# Altium schematic sheet Sheet1.SchDoc
size A4
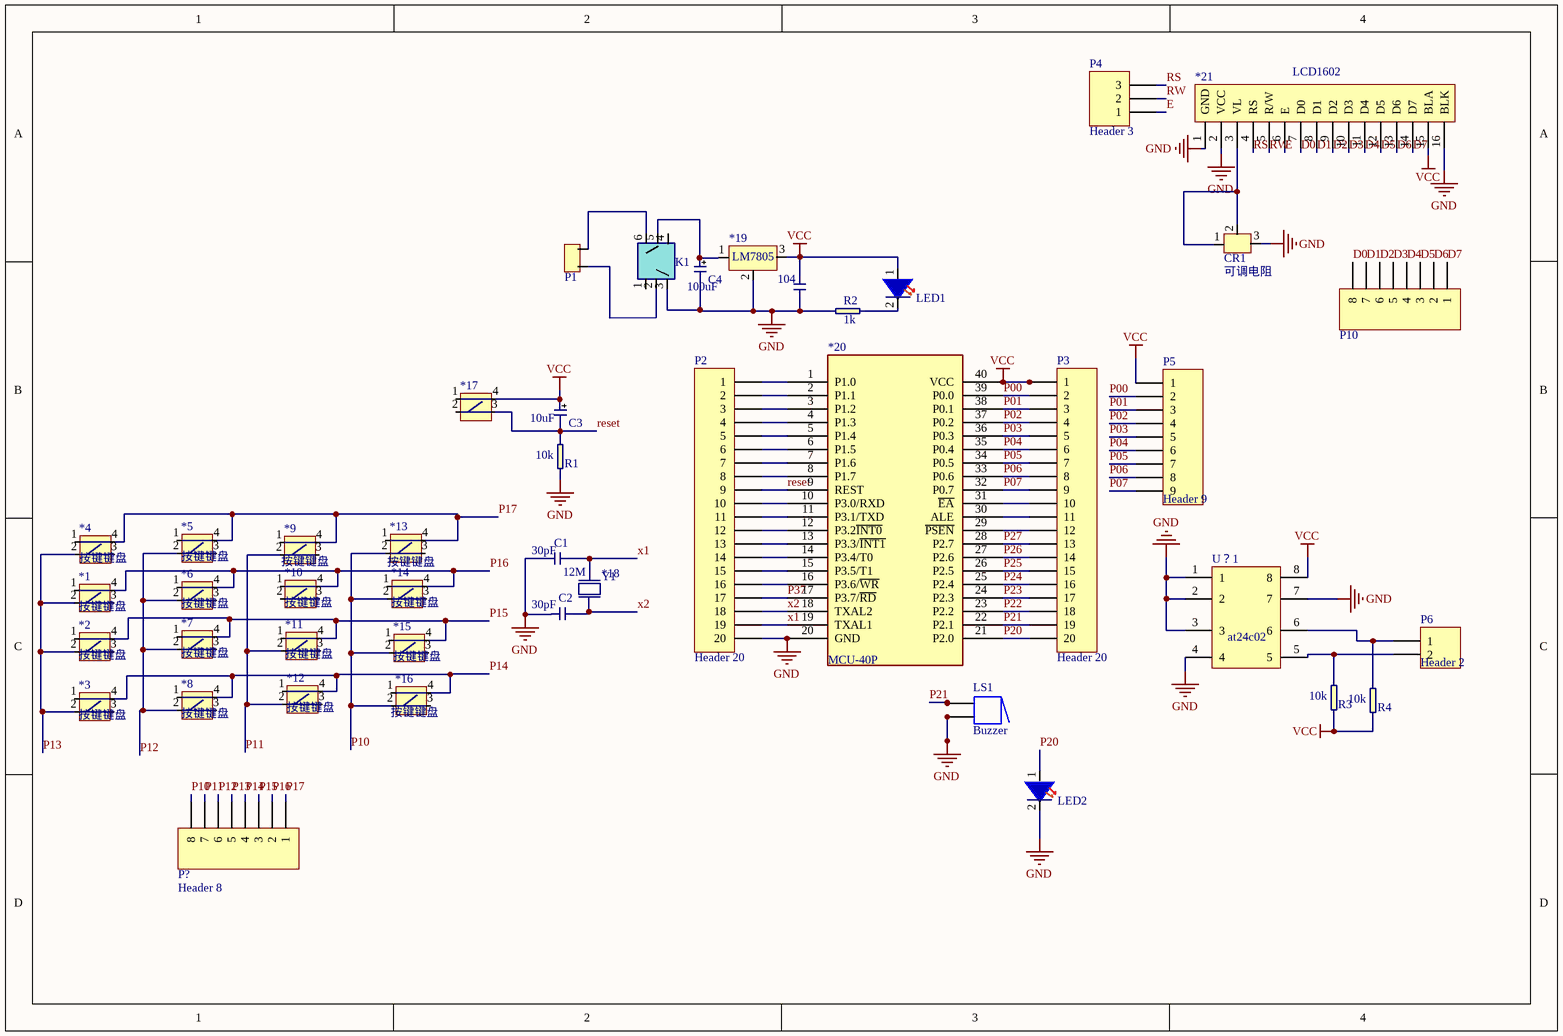
[diagram p0: Sheet1.SchDoc]

## Parts
*1  按键键盘  [按键键盘]
*2  按键键盘  [按键键盘]
*3  按键键盘  [按键键盘]
*4  按键键盘  [按键键盘]
*5  按键键盘  [按键键盘]
*6  按键键盘  [按键键盘]
*7  按键键盘  [按键键盘]
*8  按键键盘  [按键键盘]
*9  按键键盘  [按键键盘]
*10  按键键盘  [按键键盘]
*11  按键键盘  [按键键盘]
*12  按键键盘  [按键键盘]
*13  按键键盘  [按键键盘]
*14  按键键盘  [按键键盘]
*15  按键键盘  [按键键盘]
*16  按键键盘  [按键键盘]
*17  按键键盘  [按键键盘]  (value not drawn)
*18  Y1  [晶振]
*19  LM7805  [L7xxxCV]
*20  MCU-40P  [MCU-DIP40]
*21  LCD1602  [LCD1602]
C1  瓷片电容  [瓷片电容]  (value not drawn)
C2  瓷片电容  [瓷片电容]  (value not drawn)
C3  电解电容  [C8mm]  (value not drawn)
C4  电解电容  [C8mm]  (value not drawn)
C5  瓷片电容  [瓷片电容]  (value not drawn)
CR1  可调电阻  [可调电阻]
K1  自锁开关  [自锁开关]  (value not drawn)
LED1  LED  [LED]  (value not drawn)
LED2  LED  [LED]  (value not drawn)
LS1  Buzzer  [ABSM-1574]
P1  hd2  [排针x2]  (value not drawn)
P2  Header 20  [HDR1X20]
P3  Header 20  [HDR1X20]
P4  Header 3  [HD3X1]
P5  Header 9  [HD9X1]
P6  Header 2  [HD2X1]
P10  Header 8  [HD8X1]  (value not drawn)
P?  Header 8  [HD8X1]
R1  RES  [res]  (value not drawn)
R2  RES  [res]  (value not drawn)
R3  RES  [res]  (value not drawn)
R4  RES  [res]  (value not drawn)
U？1  at24c02  [DIP8]

## Nets
GND: *19.2 *20.20(GND) *21.1(GND) *21.2(VCC) *21.16(BLK) C1.1 C2.1 C4.2 C5.1 CR1.3 K1.3 LED2.2 LS1.2 LS1.2A P2.20 R1.1 R2.1 U？1.1 U？1.2 U？1.3 U？1.4 U？1.7
VCC: *17.4 *19.3 *20.40(VCC) *21.15(BLA) C3.1 C5.2 LED1.1 P3.1 P5.1 R3.1 R4.1 U？1.8
D0: *21.7(D0) P10.8
D1: *21.8(D1) P10.7
D2: *21.9(D2) P10.6
D3: *21.10(D3) P10.5
D4: *21.11(D4) P10.4
D5: *21.12(D5) P10.3
D6: *21.13(D6) P10.2
D7: *21.14(D7) P10.1
E: *21.6(E) P4.1
P00: *20.39(P0.0) P3.2 P5.2
P01: *20.38(P0.1) P3.3 P5.3
P02: *20.37(P0.2) P3.4 P5.4
P03: *20.36(P0.3) P3.5 P5.5
P04: *20.35(P0.4) P3.6 P5.6
P05: *20.34(P0.5) P3.7 P5.7
P06: *20.33(P0.6) P3.8 P5.8
P07: *20.32(P0.7) P3.9 P5.9
P10: *13.2 *14.2 *15.2 *16.2 P?.8
P11: *9.2 *11.2 *12.2 P?.7
P12: *5.2 *6.2 *7.2 *8.2 P?.6
P13: *1.2 *2.2 *3.2 *4.2 P?.5
P14: *3.4 *8.4 *12.4 *16.4 P?.4
P15: *2.4 *7.4 *11.4 *15.4 P?.3
P16: *1.4 *6.4 *10.4 *14.4 P?.2
P17: *4.4 *5.4 *9.4 *13.4 P?.1
P20: *20.21(P2.0) LED2.1 P3.20
P21: *20.22(P2.1) LS1.1 LS1.1A P3.19
P22: *20.23(P2.2) P3.18
P23: *20.24(P2.3) P3.17
P24: *20.25(P2.4) P3.16
P25: *20.26(P2.5) P3.15
P26: *20.27(P2.6) P3.14
P27: *20.28(P2.7) P3.13
P37: *20.17(P3.7/~{RD}) P2.17
reset: *17.3 *20.9(REST) C3.2 P2.9 R1.2
RS: *21.4(RS) P4.3
RW: *21.5(R/W) P4.2
x1: *18.1 *20.19(TXAL1) C1.2 P2.19
x2: *18.2 *20.18(TXAL2) C2.2 P2.18
Net*19_1: *19.1 C4.1 K1.5
Net*20_1: *20.1(P1.0) P2.1
Net*20_2: *20.2(P1.1) P2.2
Net*20_3: *20.3(P1.2) P2.3
Net*20_4: *20.4(P1.3) P2.4
Net*20_5: *20.5(P1.4) P2.5
Net*20_6: *20.6(P1.5) P2.6
Net*20_7: *20.7(P1.6) P2.7
Net*20_8: *20.8(P1.7) P2.8
Net*20_10: *20.10(P3.0/RXD) P2.10
Net*20_11: *20.11(P3.1/TXD) P2.11
Net*20_12: *20.12(P3.2~{INT0}) P2.12
Net*20_13: *20.13(P3.3/~{INT1}) P2.13
Net*20_14: *20.14(P3.4/T0) P2.14
Net*20_15: *20.15(P3.5/T1) P2.15
Net*20_16: *20.16(P3.6/~{WR}) P2.16
Net*20_29: *20.29(~{PSEN}) P3.12
Net*20_30: *20.30(ALE) P3.11
Net*20_31: *20.31(~{EA}) P3.10
Net*21_3: *21.3(VL) CR1.1 CR1.2
NetK1_2: K1.2 P1.2
NetK1_6: K1.6 P1.1
NetLED1_2: LED1.2 R2.2
NetP6_1: P6.1 R4.2 U？1.6
NetP6_2: P6.2 R3.2 U？1.5

Not connected (* = marked no-connect by the designer): *1 1 3; *2 1 3; *3 1 3; *4 1 3; *5 1 3; *6 1 3; *7 1 3; *8 1 3; *9 1 3; *10 1 2 3; *11 1 3; *12 1 3; *13 1 3; *14 1 3; *15 1 3; *16 1 3; *17 1 2; K1 1 4

## Notes on the sheet
- (in symbol RES) 10k; 1k
- (in symbol Y1) 12M
- (in symbol 瓷片电容) 30pF; 104
- (in symbol 电解电容) 10uF; 100uF

## Library data of the parts
*19 = L7xxxCV
LS1 = Buzzer: Magnetic Transducer Buzzer; Published: 24-Mar-1999; LatestRevisionDate: 17-Dec-2003; LatestRevisionNote: Schematic revised, PCB Footprint replaced.; DatasheetDocument: 17-Dec-2003; PackageReference: ABSM-1574; Publisher: Altium Limited; ComponentLink1Description: Manufacturer Link; ComponentLink1URL: http://www.megastar.com/linecard/buzzmode/index.php
P2 P3 = Header 20: Header, 20-Pin; LatestRevisionDate: 17-Jul-2002; LatestRevisionNote: Re-released for DXP Platform.; Publisher: Altium Limited
P4 = Header 3: Header, 3-Pin; LatestRevisionDate: 17-Jul-2002; LatestRevisionNote: Re-released for DXP Platform.; Publisher: Altium Limited
P5 = Header 9: Header, 9-Pin; LatestRevisionDate: 17-Jul-2002; LatestRevisionNote: Re-released for DXP Platform.; Publisher: Altium Limited
P6 = Header 2: Header, 2-Pin; LatestRevisionDate: 17-Jul-2002; LatestRevisionNote: Re-released for DXP Platform.; Publisher: Altium Limited
P10 P? = Header 8: Header, 8-Pin; LatestRevisionDate: 17-Jul-2002; LatestRevisionNote: Re-released for DXP Platform.; Publisher: Altium Limited
U？1 = DIP8